# Altium schematic sheet Audio.SchDoc
size A
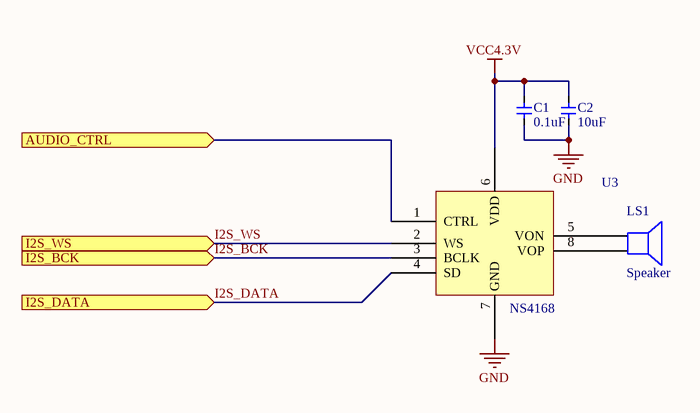
[diagram p0: Audio.SchDoc]

## Parts
C1  value 0.1uF  [CAP_0603]  (hidden comment: Cap_0603)
C2  value 10uF  [CAP_0603]  (hidden comment: Cap_0603)
LS1  Speaker  [PIN2]
U3  NS4168  [SOP_E150_8]

## Ports
AUDIO_CTRL (in), I2S_BCK (in), I2S_DATA (in), I2S_WS (in)

## Nets
GND: C1.1 C2.1 U3.7(GND)
VCC4.3V: C1.2 C2.2 U3.6(VDD)
AUDIO_CTRL: U3.1(CTRL) ; port AUDIO_CTRL
I2S_BCK: U3.3(BCLK) ; port I2S_BCK
I2S_DATA: U3.4(SD) ; port I2S_DATA
I2S_WS: U3.2(WS) ; port I2S_WS
NetLS1_1: LS1.1 U3.5(VON)
NetLS1_2: LS1.2 U3.8(VOP)

## Library data of the parts
C1 C2 = Cap_0603: Capacitor
LS1 = Speaker: Loudspeaker; Published: 24-Mar-1999; LatestRevisionDate: 17-Jul-2002; LatestRevisionNote: Re-released for DXP Platform.; PackageReference: PIN2; Publisher: Altium Limited
U3 = NS4168: D Class Audio Amp with I2S input